# Altium schematic sheet LED_POWER.SchDoc
size A; SheetNumber: 27; SheetTotal: 30
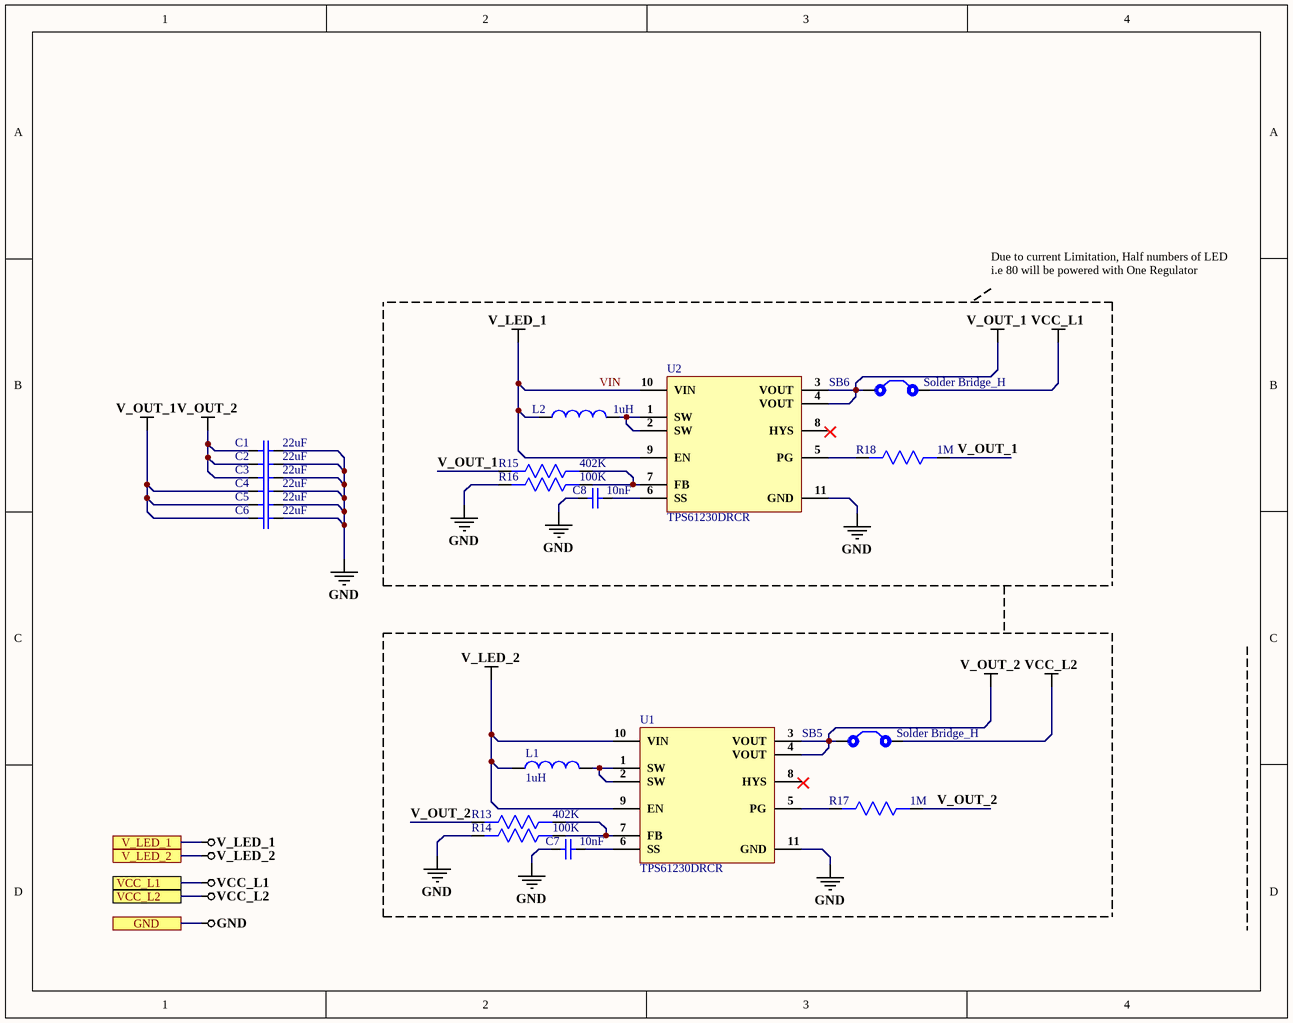
[diagram p0: LED_POWER.SchDoc]

## Parts
C1  22uF  [Cap0805]
C2  22uF  [Cap0805]
C3  22uF  [Cap0805]
C4  22uF  [Cap0805]
C5  22uF  [Cap0805]
C6  22uF  [Cap0805]
C7  10nF  [CAP 0201]
C8  10nF  [CAP 0201]
L1  1uH  [1255AY-1R0N=P3]
L2  1uH  [1255AY-1R0N=P3]
R13  402K  [Res0603]
R14  100K  [Res0402]
R15  402K  [Res0603]
R16  100K  [Res0402]
R17  1M  [Res0402]
R18  1M  [Res0402]
SB5  Solder Bridge_H  [Solder Bridge throgh hole]
SB6  Solder Bridge_H  [Solder Bridge throgh hole]
U1  TPS61230DRCR  [10-VSON (3x3)]
U2  TPS61230DRCR  [10-VSON (3x3)]

## Ports
GND, V_LED_1, V_LED_2, VCC_L1, VCC_L2

## Nets
GND: C1.1 C2.1 C3.1 C4.1 C5.1 C6.1 C7.2 C8.2 R14.2 R16.2 U1.11(GND) U2.11(GND) ; port GND
V_LED_2: L1.2 U1.9(EN) U1.10(VIN) ; port V_LED_2
V_OUT_1: C4.2 C5.2 C6.2 R15.2 R18.1 SB6.1 U2.3(VOUT) U2.4(VOUT)
V_OUT_2: C1.2 C2.2 C3.2 R13.2 R17.1 SB5.1 U1.3(VOUT) U1.4(VOUT)
VCC_L1: SB6.2 ; port VCC_L1
VCC_L2: SB5.2 ; port VCC_L2
VIN: L2.2 U2.9(EN) U2.10(VIN) ; port V_LED_1  [also labelled V_LED_1]
NetC7_1: C7.1 U1.6(SS)
NetC8_1: C8.1 U2.6(SS)
NetL1_1: L1.1 U1.1(SW) U1.2(SW)
NetL2_1: L2.1 U2.1(SW) U2.2(SW)
NetR13_1: R13.1 R14.1 U1.7(FB)
NetR15_1: R15.1 R16.1 U2.7(FB)
NetR17_2: R17.2 U1.5(PG)
NetR18_2: R18.2 U2.5(PG)

Not connected (* = marked no-connect by the designer): U1 8(HYS); U2 8(HYS)

## Notes on the sheet
- Due to current Limitation, Half numbers of LED i.e 80 will be powered with One Regulator

## Library data of the parts
C1-C6 = GRM21BR60J226ME39K: CAP CER 22UF 6.3V X5R 0805; Manufacturer: Murata; Tolerance: 20%; Supplier 1: Digi-Key; Manufacturer Part Number: GRM21BR60J226ME39K; RoHS: Yes; Category: Ceramic Capacitors; Stock 1: 70081; Pricing 1: 1=0.33000, 10=0.22500, 50=0.15020, 100=0.12770, 500=0.09012, 1000=0.07886, 2500=0.07511, 5000=0.06947 (USD); Mount: Surface Mount; Case/Package: 0805; Case Code (Metric): 2012; Case Code (Imperial): 0805; Min Operating Temperature: -55°C; Max Operating Temperature: 85°C; Package Quantity: 1; Capacitance: 22uF; Voltage Rating: 6.3V; Packaging: Tape and Reel; Voltage Rating (DC): 6.3V; Dielectric: X5R; Termination: SMD/SMT; Voltage: 6.3V; Series: GRM; Construction: Flat; Length: 2mm; Width: 0.049inch; Height: 1.25mm; Thickness: 0.053inch; Depth: 1.25mm; Radiation Hardening: No; Lead Free: Lead Free; RoHS Compliant: Yes; ComponentLink1URL: https://datasheet.ciiva.com/6270/partnumbering-e-01-6270375.pdf?src-supplier=Digi-Key; ComponentLink1Description: https://datasheet.ciiva.com/6270/partnumbering-e-01-6270375.pdf?src-supplier=Digi-Key; ComponentLink2URL: https://datasheet.ciiva.com/6270/partnumbering-e-01-6270377.pdf?src-supplier=Digi-Key; ComponentLink2Description: https://datasheet.ciiva.com/6270/partnumbering-e-01-6270377.pdf?src-supplier=Digi-Key; ComponentLink3URL: https://datasheet.ciiva.com/5413/product-5413083.pdf?src-supplier=Mouser; ComponentLink3Description: https://datasheet.ciiva.com/5413/product-5413083.pdf?src-supplier=Mouser; ComponentLink4URL: https://datasheet.ciiva.com/11607/product-11607325.pdf?src-supplier=Avnet; ComponentLink4Description: https://datasheet.ciiva.com/11607/product-11607325.pdf?src-supplier=Avnet; Supplier Part Number 1: 490-6471-1-ND
C7 C8 = GRM033R71C103KE14D: CAP CER 10000PF 16V X7R 0201; Manufacturer: Murata; Tolerance: 10%; Supplier 1: Digi-Key; Manufacturer Part Number: GRM033R71C103KE14D; RoHS: Yes; Category: Ceramic Capacitors; Stock 1: 12651; Pricing 1: 1=0.10000, 10=0.01700, 50=0.00920, 100=0.00750, 500=0.00540, 1000=0.00424, 2500=0.00385, 5000=0.00354 (USD); Voltage Rating (DC): 16V; Dielectric: X7R; Capacitance: 10nF; Length: 600um; Width: 300um; Thickness: 300um; RoHS Compliant: Yes; ComponentLink1URL: http://www.farnell.com/datasheets/2867848.pdf?src-supplier=Farnell; ComponentLink1Description: http://www.farnell.com/datasheets/2867848.pdf?src-supplier=Farnell; ComponentLink2URL: http://search.murata.co.jp/Ceramy/image/img/A01X/G101/ENG/GRM033R71C103KE14-01.pdf?src-supplier=Digi-Key; ComponentLink2Description: http://search.murata.co.jp/Ceramy/image/img/A01X/G101/ENG/GRM033R71C103KE14-01.pdf?src-supplier=Digi-Key; ComponentLink3URL: http://www.farnell.com/datasheets/2867848.pdf?src-supplier=Newark; ComponentLink3Description: http://www.farnell.com/datasheets/2867848.pdf?src-supplier=Newark; ComponentLink4URL: http://www.farnell.com/datasheets/2722745.pdf?src-supplier=Element14; ComponentLink4Description: http://www.farnell.com/datasheets/2722745.pdf?src-supplier=Element14; Supplier Part Number 1: 490-14453-1-ND
L1 L2 = 1255AY-1R0N=P3: FIXED IND 1UH 6.5A 10 MOHM SMD; Manufacturer: Murata; Core Material: Ferrite; Current Rating: 9.5A; Shielding: Shielded; DC Resistance (DCR): 12mR; Test Frequency: 100kHz; Tolerance: 30%; Supplier 1: Digi-Key; Manufacturer Part Number: 1255AY-1R0N=P3; RoHS: Yes; Category: Fixed Inductors; Stock 1: 492; Pricing 1: 1=0.42000, 10=0.36800, 25=0.34120, 50=0.28880, 100=0.26250, 250=0.24676, 500=0.22050 (USD); Mount: Surface Mount; Case/Package: Nonstandard; Packaging: Tape and Reel; Resistor Type: Wirewound; Inductance: 1uH; Max DC Current: 6.5A; Length: 0.248inch; Width: 0.248inch; Height - Seated (Max): 0.177inch; RoHS Compliant: Yes; ComponentLink1URL: http://www.farnell.com/datasheets/2616880.pdf?src-supplier=Farnell; ComponentLink1Description: http://www.farnell.com/datasheets/2616880.pdf?src-supplier=Farnell; ComponentLink2URL: http://search.murata.co.jp/Ceramy/image/img/P02/J(E)TE243B-0037_DG6045C_reference.pdf?src-supplier=Digi-Key; ComponentLink2Description: http://search.murata.co.jp/Ceramy/image/img/P02/J(E)TE243B-0037_DG6045C_reference.pdf?src-supplier=Digi-Key; ComponentLink3URL: http://www.toko.co.jp/products/pdf/inductors/dg6045c.pdf?src-supplier=Digi-Key; ComponentLink3Description: http://www.toko.co.jp/products/pdf/inductors/dg6045c.pdf?src-supplier=Digi-Key; ComponentLink4URL: http://www.toko.co.jp/products/pdf/inductors/dg6045c.pdf?src-supplier=Avnet; ComponentLink4Description: http://www.toko.co.jp/products/pdf/inductors/dg6045c.pdf?src-supplier=Avnet; Supplier Part Number 1: 490-10803-1-ND
R13 R15 = RK73H1JTTD4023F: RES 402K OHM 1% 1/10W 0603; Manufacturer: KOA Speer; Resistance: 402kR; Power Rating: 100mW; Voltage Rating: 50V; Temperature Coefficient: 100ppm/°C; Supplier 1: Digi-Key; Manufacturer Part Number: RK73H1JTTD4023F; RoHS: Yes; Category: Chip SMD Resistors; Stock 1: 50000; Pricing 1: 1=0.10000, 10=0.02200, 100=0.00910, 1000=0.00408, 2500=0.00354 (USD); Case/Package: 0603; Case Code (Imperial): 0603; Case Code (Metric): 1608; Min Operating Temperature: -55°C; Max Operating Temperature: 155°C; Tolerance: 1%; Packaging: Tape and Reel; Resistor Type: Thick Film; Termination: SMD/SMT; Voltage Rating (DC): 50V; Series: RK73H; Construction: Rectangular; Length: 1.6mm; Depth: 0.8mm; Military Standard: Not; Lead Free: Lead Free; RoHS Compliant: Yes; ComponentLink1URL: https://datasheet.ciiva.com/5553/rk73h-5553241.pdf?src-supplier=Mouser; ComponentLink1Description: https://datasheet.ciiva.com/5553/rk73h-5553241.pdf?src-supplier=Mouser; Supplier Part Number 1: 2019-RK73H1JTTD4023FCT-ND
R14 R16 = RK73H1ETTP1003F: RES 100K OHM 1% 1/10W 0402; Manufacturer: KOA Speer; Manufacturer Series: RK73H; Voltage Rating: 50V; Resistance: 100kR; Power Rating: 63mW; Temperature Coefficient: 100ppm/°C; Additional Feature: PRECISION; Supplier 1: Digi-Key; Manufacturer Part Number: RK73H1ETTP1003F; RoHS: Yes; Category: Chip SMD Resistors; Stock 1: 373472; Pricing 1: 1=0.10000, 10=0.02400, 100=0.00970, 1000=0.00437, 2500=0.00380, 5000=0.00314 (USD); Case/Package: 0402; Case Code (Imperial): 0402; Case Code (Metric): 1005; Package Shape: Rectangular; Size Code: 0402; Terminal Finish: Tin; Min Operating Temperature: -55°C; Max Operating Temperature: 155°C; Packaging: Tape and Reel; Package Quantity: 10000; Tolerance: 1%; Resistor Type: Thick Film; Termination: SMD/SMT; Working Voltage: 50V; Voltage Rating (DC): 50V; Series: RK73H; Technology: METAL GLAZE/THICK FILM; Construction: Rectangular; Length: 1mm; Width: 0.5mm; Height: 0.35mm; Depth: 0.5mm; Military Standard: Not; Lead Free: Lead Free; RoHS Compliant: Yes; ComponentLink1URL: http://www.mouser.com/ds/2/219/RK73H-5715.pdf?src-supplier=Mouser; ComponentLink1Description: http://www.mouser.com/ds/2/219/RK73H-5715.pdf?src-supplier=Mouser; ComponentLink2URL: http://www.jameco.com/Jameco/Products/ProdDS/1882455.pdf?src-supplier=Jameco; ComponentLink2Description: http://www.jameco.com/Jameco/Products/ProdDS/1882455.pdf?src-supplier=Jameco; ComponentLink3URL: http://components.arrow.com/part/dataview/39721605S6492599N5146?src-supplier=Arrow+Electronics; ComponentLink3Description: http://components.arrow.com/part/dataview/39721605S6492599N5146?src-supplier=Arrow+Electronics; ComponentLink4URL: https://www.verical.com/server-webapp/html/getDatasheet?partID=26325&src-supplier=Verical; ComponentLink4Description: https://www.verical.com/server-webapp/html/getDatasheet?partID=26325&src-supplier=Verical; Supplier Part Number 1: 2019-RK73H1ETTP1003FCT-ND
R17 R18 = RK73G1ETTP1004F: RES 1M OHM 1% 1/10W 0402; Manufacturer: KOA Speer; Resistance: 4R; Supplier 1: Digi-Key; Manufacturer Part Number: RK73G1ETTP1004F; RoHS: Yes; Category: Chip SMD Resistors; Stock 1: 8474; Pricing 1: 1=0.29000, 10=0.24200, 100=0.09460, 1000=0.03960, 2500=0.03630, 5000=0.03300 (USD); Case/Package: 0402; Case Code (Imperial): 0402; Case Code (Metric): 1005; Packaging: Tape and Reel; Package Quantity: 10000; Termination: SMD/SMT; Series: RK73G; Length: 1mm; Width: 0.5mm; Height: 0.35mm; RoHS Compliant: Yes; ComponentLink1URL: http://www.mouser.com/ds/2/219/RK73G-9863.pdf?src-supplier=Mouser; ComponentLink1Description: http://www.mouser.com/ds/2/219/RK73G-9863.pdf?src-supplier=Mouser; Supplier Part Number 1: 2019-RK73G1ETTP1004FCT-ND
SB5 SB6 = Solder Bridge Trough hole: Solder Bridge ON
U1 U2 = TPS61230DRCR: IC REG BOOST ADJ 4A 10VSON; Manufacturer: Texas Instruments; Number of Outputs: 1; Output Voltage: 5.5V; Max Output Current: 2.1A; Min Input Voltage: 2.3V; Efficiency: 96%; Min Output Voltage: 2.5V; Switching Frequency: 2MHz; Synchronous Rectifier: Yes; Quiescent Current: 35uA; Output Type: Adjustable; Output Configuration: Positive; Supplier 1: Digi-Key; Manufacturer Part Number: TPS61230DRCR; RoHS: Yes; Category: Power Supply Modules; Stock 1: 42459; Pricing 1: 1=2.61000, 10=2.34800, 25=2.21520, 100=1.77230, 250=1.55080, 500=1.50648, 1000=1.19632 (USD); Number of Pins: 10; Weight: 0.001058oz; Contact Plating: Gold; Min Operating Temperature: -40°C; Max Operating Temperature: 85°C; Max Input Voltage: 5.5V; Packaging: Tape and Reel; Max Output Voltage: 5.5V; Output Current: 2.1A; Package Quantity: 3000; Topology: Boost; Operating Supply Voltage: 5.5V; Length: 3.1mm; Width: 3.1mm; Height: 0.95mm; Radiation Hardening: No; REACH SVHC: No SVHC; Lead Free: Lead Free; RoHS Compliant: Yes; ComponentLink1URL: https://datasheet.ciiva.com/48475/tps61230-48475574.pdf?src-supplier=Avnet; ComponentLink1Description: https://datasheet.ciiva.com/48475/tps61230-48475574.pdf?src-supplier=Avnet; Supplier Part Number 1: 296-37761-1-ND